# Altium schematic sheet LIDO-HW.100.Page_5.SchDoc
size A3; SheetNumber: 9; SheetTotal: 14
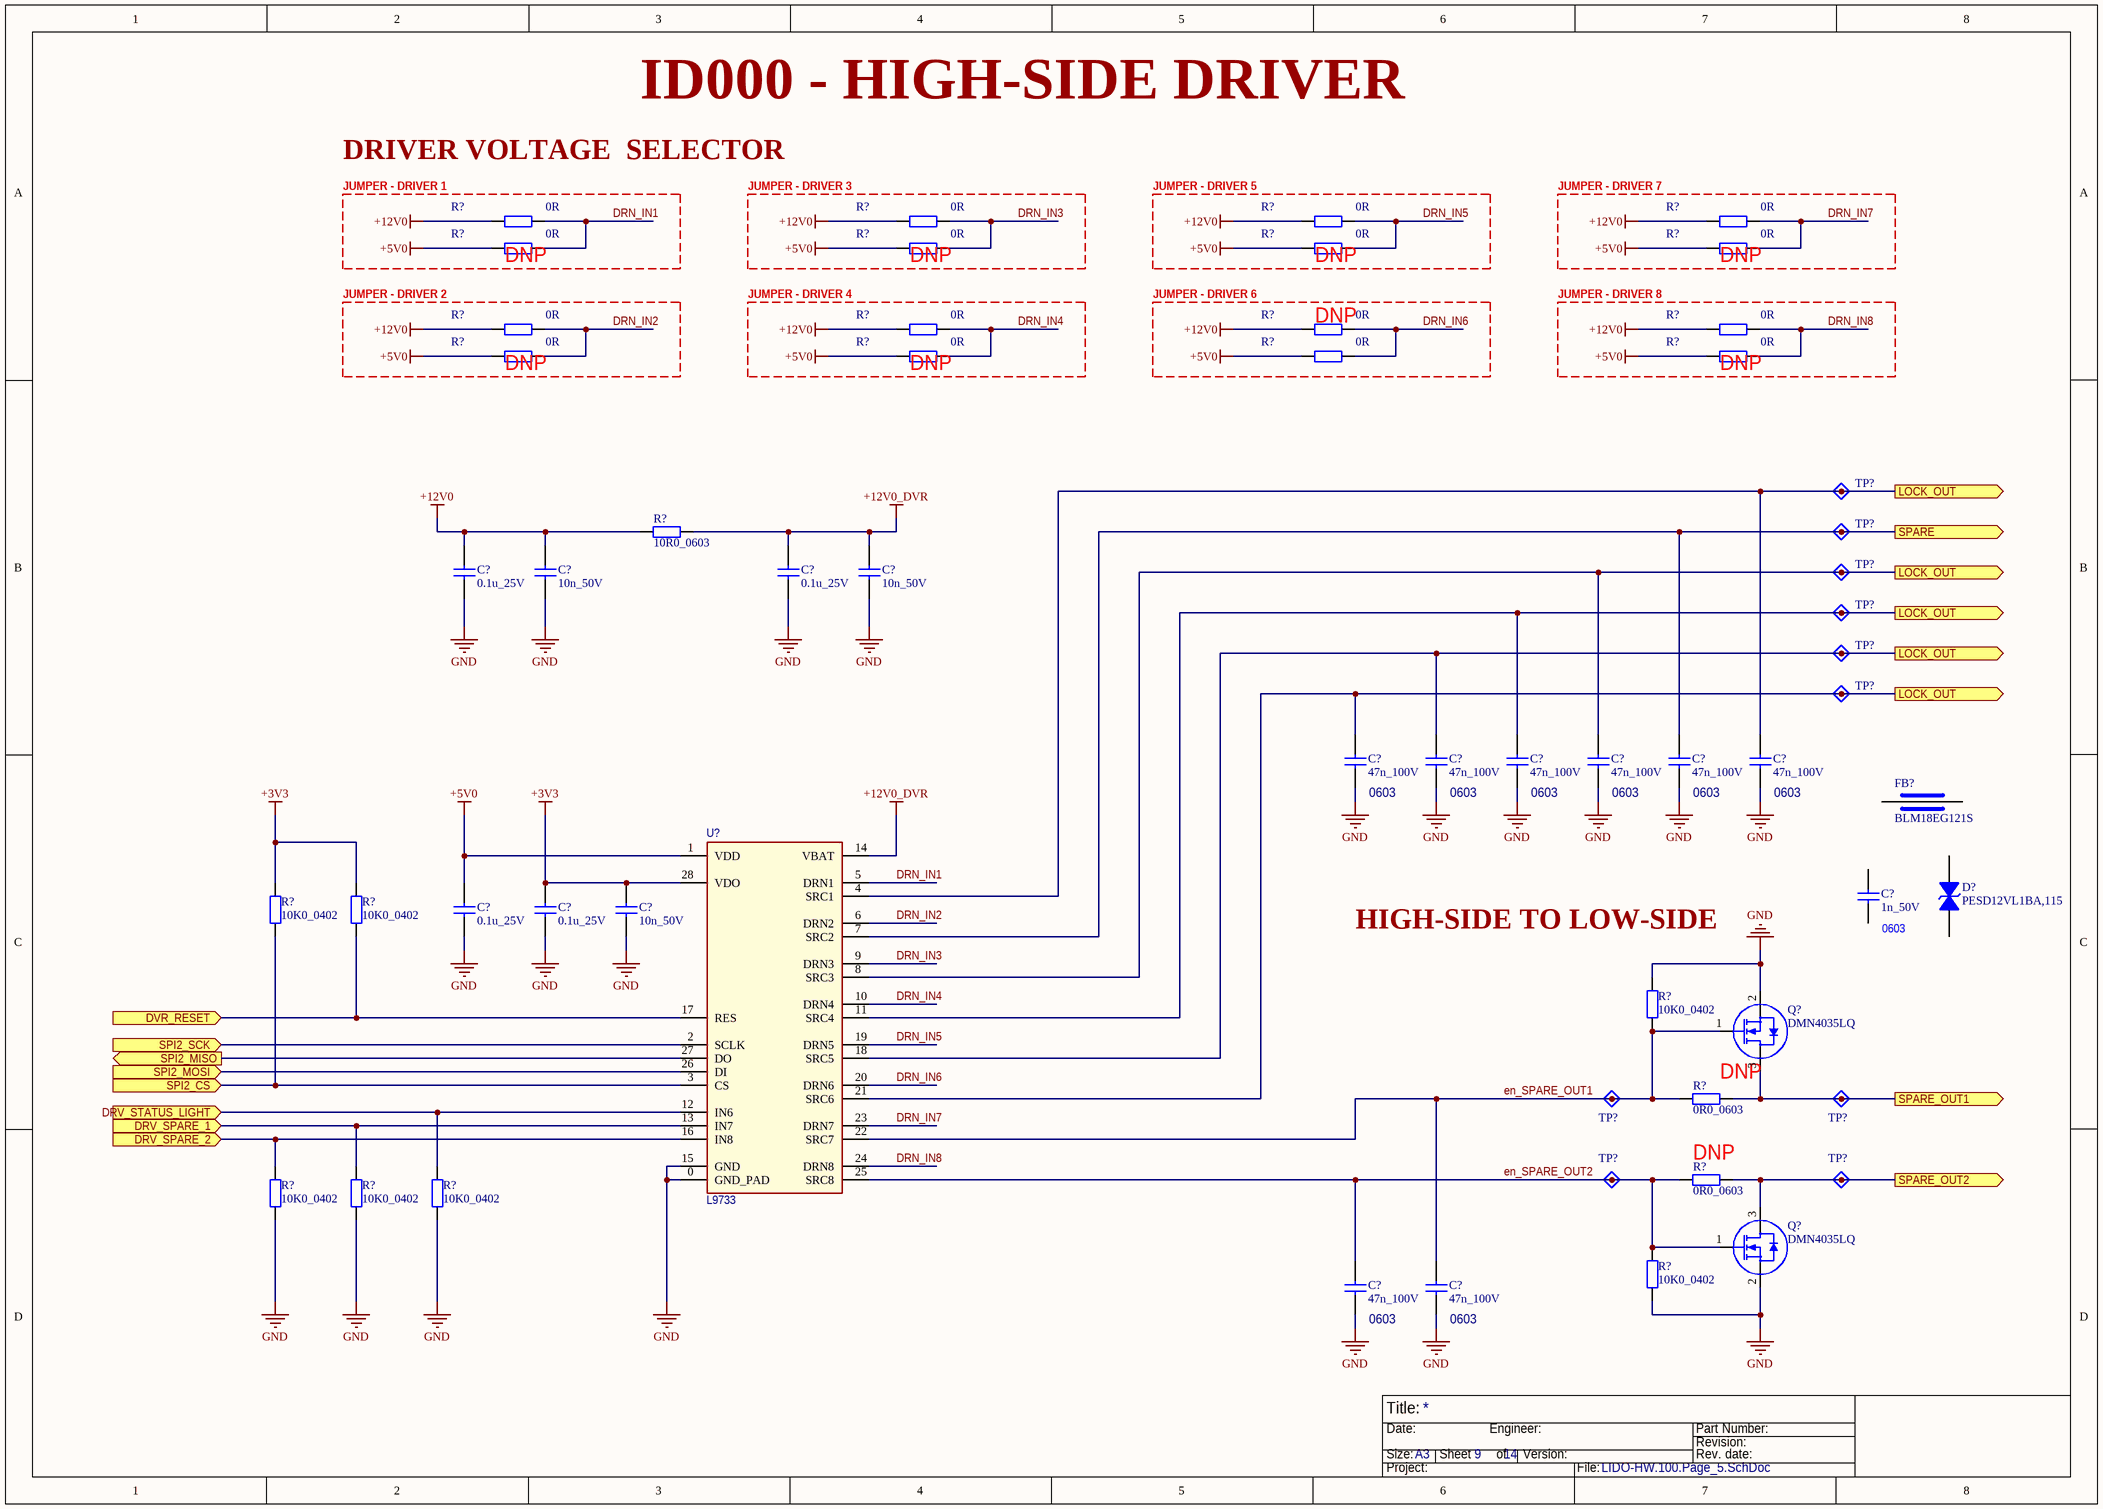
[diagram p0: LIDO-HW.100.Page_5.SchDoc]

## Parts
(Parts that share a designator on the sheet are numbered #1, #2 ... from top to bottom, then left to right.)
C?#1  0.1u_25V
C?#2  10n_50V
C?#3  0.1u_25V
C?#4  10n_50V
C?#5  47n_100V
C?#6  47n_100V
C?#7  47n_100V
C?#8  47n_100V
C?#9  47n_100V
C?#10  47n_100V
C?#11  1n_50V
C?#12  0.1u_25V
C?#13  0.1u_25V
C?#14  10n_50V
C?#15  47n_100V
C?#16  47n_100V
D?  PESD12VL1BA,115
FB?  BLM18EG121S
Q?#1  DMN4035LQ
Q?#2  DMN4035LQ
R?#1  0R
R?#2  0R
R?#3  0R
R?#4  0R
R?#5  0R
R?#6  0R
R?#7  0R
R?#8  0R
R?#9  0R
R?#10  0R
R?#11  0R
R?#12  0R
R?#13  0R
R?#14  0R
R?#15  0R
R?#16  0R
R?#17  10R0_0603
R?#18  10K0_0402
R?#19  10K0_0402
R?#20  10K0_0402
R?#21  0R0_0603
R?#22  0R0_0603
R?#23  10K0_0402
R?#24  10K0_0402
R?#25  10K0_0402
R?#26  10K0_0402
TP?#1  TestPoint_A  (value not drawn)  (no BOM)
TP?#2  TestPoint_A  (value not drawn)  (no BOM)
TP?#3  TestPoint_A  (value not drawn)  (no BOM)
TP?#4  TestPoint_A  (value not drawn)  (no BOM)
TP?#5  TestPoint_A  (value not drawn)  (no BOM)
TP?#6  TestPoint_A  (value not drawn)  (no BOM)
TP?#7  TestPoint_A  (value not drawn)  (no BOM)
TP?#8  TestPoint_A  (value not drawn)  (no BOM)
TP?#9  TestPoint_A  (value not drawn)  (no BOM)
TP?#10  TestPoint_A  (value not drawn)  (no BOM)
U?  L9733

## Blocks framed on the sheet
DNP: R?#1 R?#5
DNP: R?#2 R?#6
DNP: R?#3 R?#7
DNP: R?#4 R?#8
DNP: R?#9 R?#13
DNP: R?#10 R?#14
DNP: R?#11 R?#15
DNP: R?#12 R?#16

## Ports
DRV_SPARE_1 (in), DRV_SPARE_2 (in), DRV_STATUS_LIGHT (in), DVR_RESET (in), LOCK_OUT (out), SPARE (out), SPARE_OUT1 (out), SPARE_OUT2 (out), SPI2_CS (in), SPI2_MISO (out), SPI2_MOSI (in), SPI2_SCK (in)

## Nets
+3V3: C?#13.1 C?#14.1 R?#18.1 R?#19.1 U?.28(VDO)
+5V0: C?#12.1 R?#5.1 R?#6.1 R?#7.1 R?#8.1 R?#13.1 R?#14.1 R?#15.1 R?#16.1 U?.1(VDD)
+12V0: C?#1.1 C?#2.1 R?#1.1 R?#2.1 R?#3.1 R?#4.1 R?#9.1 R?#10.1 R?#11.1 R?#12.1 R?#17.2
+12V0_DVR: C?#3.1 C?#4.1 R?#17.1 U?.14(VBAT)
GND: C?#1.2 C?#2.2 C?#3.2 C?#4.2 C?#5.2 C?#6.2 C?#7.2 C?#8.2 C?#9.2 C?#10.2 C?#12.2 C?#13.2 C?#14.2 C?#15.2 C?#16.2 Q?#1.2(S) Q?#2.2(S) R?#20.2 R?#23.2 R?#24.2 R?#25.2 R?#26.2 U?.0(GND_PAD) U?.15(GND)
DRN_IN1: R?#1.2 R?#5.2 U?.5(DRN1)
DRN_IN2: R?#9.2 R?#13.2 U?.6(DRN2)
DRN_IN3: R?#2.2 R?#6.2 U?.9(DRN3)
DRN_IN4: R?#10.2 R?#14.2 U?.10(DRN4)
DRN_IN5: R?#3.2 R?#7.2 U?.19(DRN5)
DRN_IN6: R?#11.2 R?#15.2 U?.20(DRN6)
DRN_IN7: R?#4.2 R?#8.2 U?.23(DRN7)
DRN_IN8: R?#12.2 R?#16.2 U?.24(DRN8)
DRV_SPARE_1: R?#24.1 U?.13(IN7) ; port DRV_SPARE_1
DRV_SPARE_2: R?#23.1 U?.16(IN8) ; port DRV_SPARE_2
DRV_STATUS_LIGHT: R?#25.1 U?.12(IN6) ; port DRV_STATUS_LIGHT
DVR_RESET: R?#19.2 U?.17(RES) ; port DVR_RESET
en_SPARE_OUT1: C?#16.1 Q?#1.1(G) R?#20.1 R?#21.2 TP?#7.1(TP) U?.22(SRC7)
en_SPARE_OUT2: C?#15.1 Q?#2.1(G) R?#22.2 R?#26.1 TP?#9.1(TP) U?.25(SRC8)
LOCK_OUT: C?#5.1 C?#6.1 C?#7.1 C?#8.1 C?#10.1 TP?#1.1(TP) TP?#3.1(TP) TP?#4.1(TP) TP?#5.1(TP) TP?#6.1(TP) U?.4(SRC1) U?.8(SRC3) U?.11(SRC4) U?.18(SRC5) U?.21(SRC6) ; port LOCK_OUT
SPARE: C?#9.1 TP?#2.1(TP) U?.7(SRC2) ; port SPARE
SPARE_OUT1: Q?#1.3(D) R?#21.1 TP?#8.1(TP) ; port SPARE_OUT1
SPARE_OUT2: Q?#2.3(D) R?#22.1 TP?#10.1(TP) ; port SPARE_OUT2
SPI2_CS: R?#18.2 U?.3(CS) ; port SPI2_CS
SPI2_MISO: U?.27(DO) ; port SPI2_MISO
SPI2_MOSI: U?.26(DI) ; port SPI2_MOSI
SPI2_SCK: U?.2(SCLK) ; port SPI2_SCK

Not connected (* = marked no-connect by the designer): C?#11 1 2; D? A C; FB? 1 2

## Notes on the sheet
- ID000 - HIGH-SIDE DRIVER
- DRIVER VOLTAGE  SELECTOR
- JUMPER - DRIVER 1
- JUMPER - DRIVER 3
- JUMPER - DRIVER 5
- JUMPER - DRIVER 7
- JUMPER - DRIVER 2
- JUMPER - DRIVER 4
- JUMPER - DRIVER 6
- JUMPER - DRIVER 8
- (near C?#5) 0603
- (near C?#6) 0603
- (near C?#7) 0603
- (near C?#8) 0603
- (near C?#9) 0603
- (near C?#10) 0603
- HIGH-SIDE TO LOW-SIDE
- (near C?#11) 0603
- DNP
- (near R?#22) DNP
- (near C?#15) 0603
- (near C?#16) 0603
- Title:
- Size:
- Date:
- A3
- Sheet       of
- Engineer:
- Version:
- Part Number:
- Revision:
- Rev. date:
- Project:
- File:

## Library data of the parts
C?#1-C?#16 = Ceramic: Ceramic CAP Symbol
D? = BI-TVS_DIODE_B: Bidirectional TVS Diode Symbol
FB? = FERRITE_BEAD: Ferrite Bead Symbol
Q?#1 Q?#2 = MOSFET_N_WD_1G_2S_3D: N-Channel MOSFET with Diode
R?#1-R?#26 = Resistor: Resistor Symbol
TP?#1-TP?#10 = TestPoint_A: Test Point Symbol verion A; 00_Name: TP_XXmm; 01_Diameter: 1mm; 02_Layer: *
U? = L9733_A: Power Switch/Driver 1:8 N-Channel 1A PowerSSO-28 Exposed Pad